# Altium schematic sheet SmartLED.SchDoc: Smart LED
size B; SheetNumber: 2; SheetTotal: 6
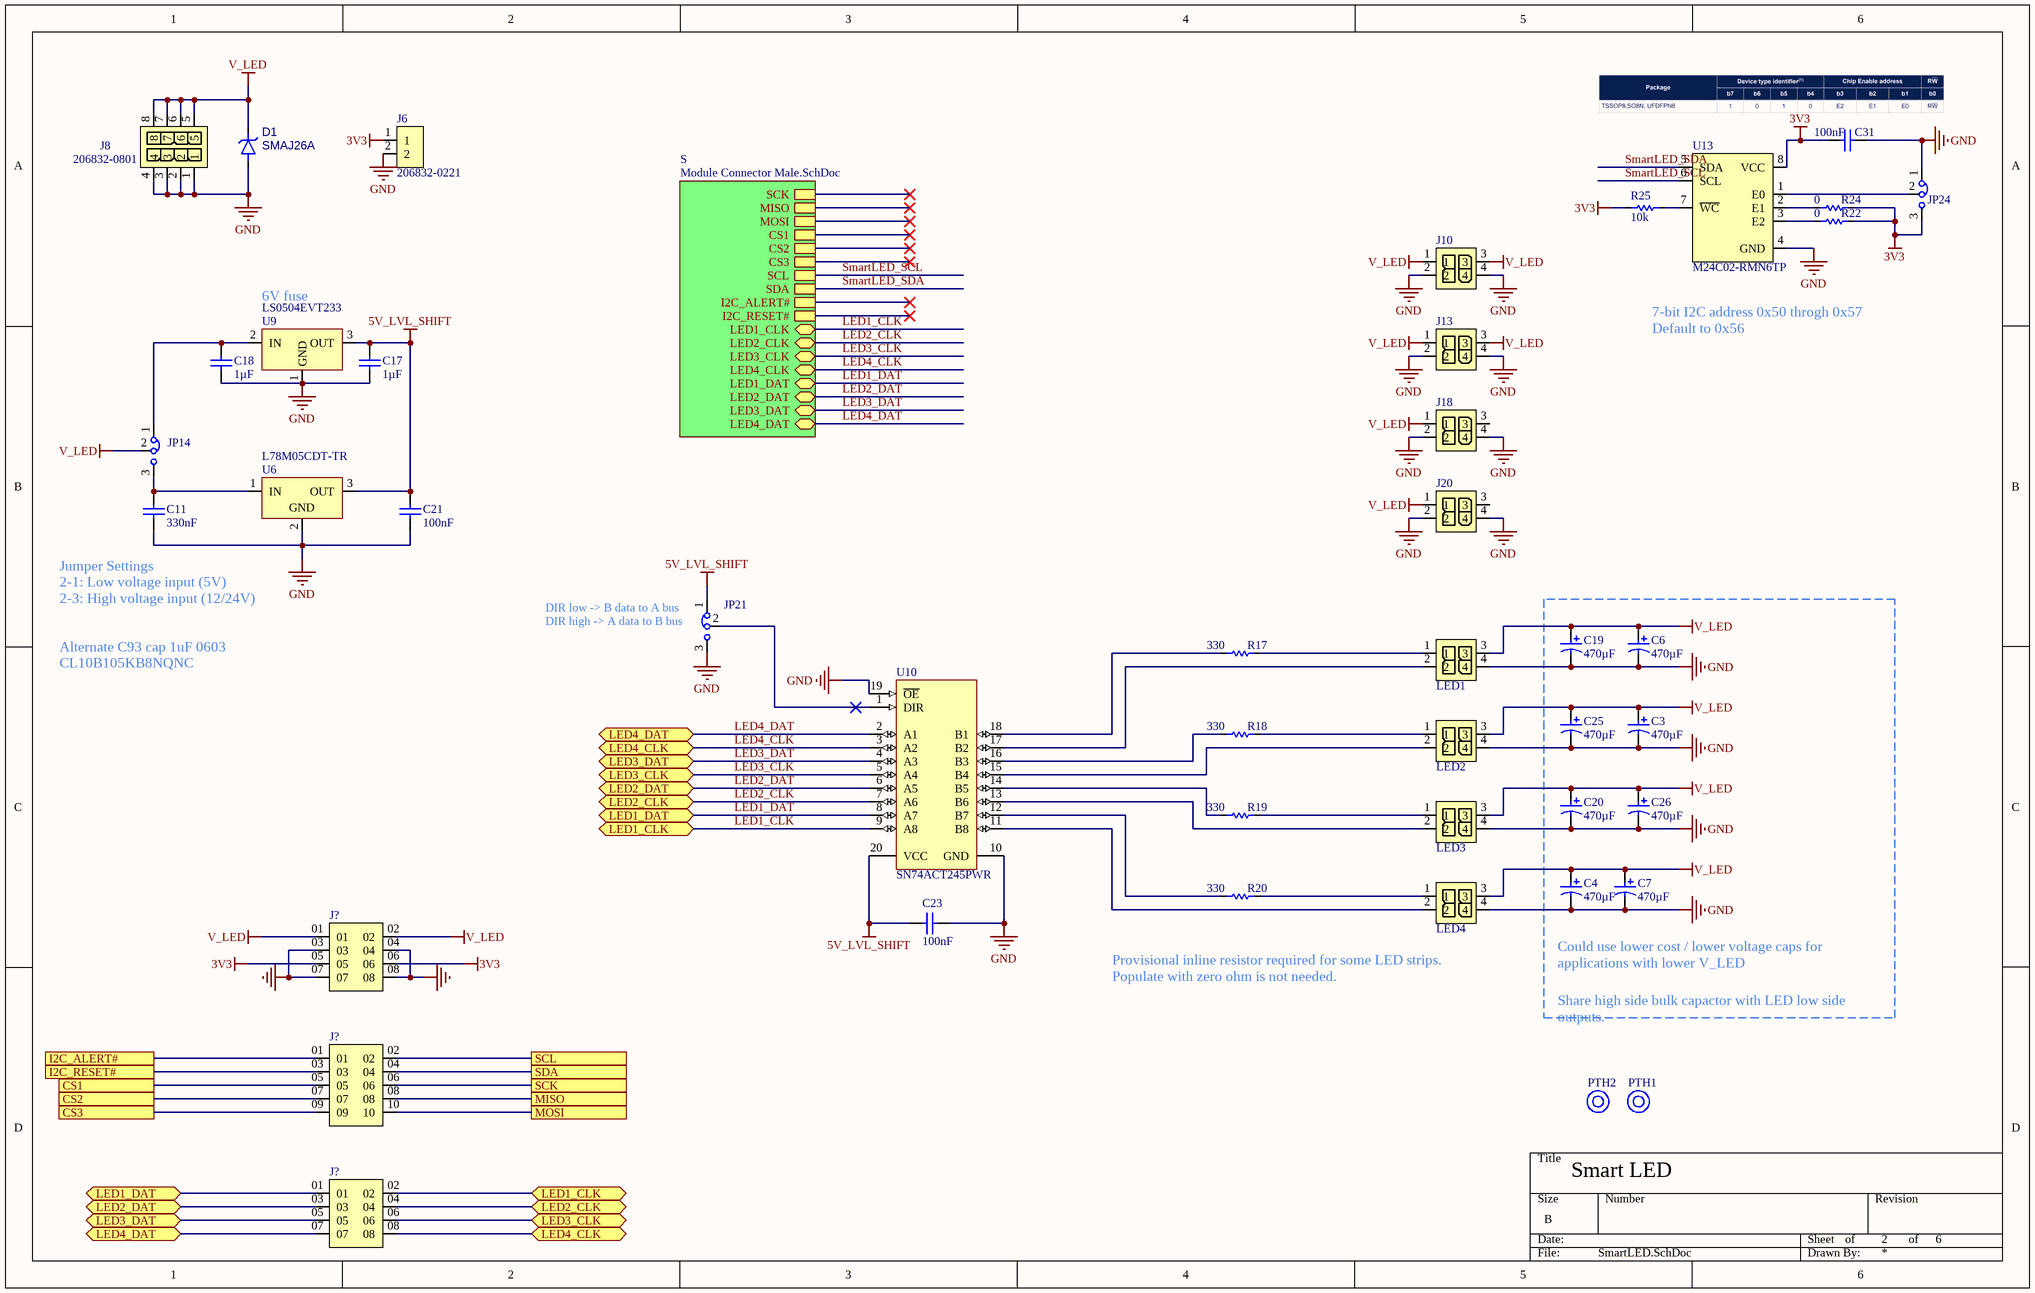
[diagram p0: SmartLED.SchDoc]

## Parts
(Parts that share a designator on the sheet are numbered #1, #2 ... from top to bottom, then left to right.)
C3  value 470µF  [CAP_POL_DIAM10_H22_SPACING5]  (hidden comment: REH1020471M050K)
C4  value 470µF  [CAP_POL_DIAM10_H22_SPACING5]  (hidden comment: REH1020471M050K)
C6  value 470µF  [CAP_POL_DIAM10_H22_SPACING5]  (hidden comment: REH1020471M050K)
C7  value 470µF  [CAP_POL_DIAM10_H22_SPACING5]  (hidden comment: REH1020471M050K)
C11  value 330nF  [CAPC1608X10N_0603_MED]  (hidden comment: CGA3E3X7R1H334K080AB)
C17  value 1µF  [CAPC1608X10N_0603_MED]  (hidden comment: C1608X7R1C105K080AC)
C18  value 1µF  [CAPC2012X14N_0805_MED]  (hidden comment: CL21B105KBFNNNE)
C19  value 470µF  [CAP_POL_DIAM10_H22_SPACING5]  (hidden comment: REH1020471M050K)
C20  value 470µF  [CAP_POL_DIAM10_H22_SPACING5]  (hidden comment: REH1020471M050K)
C21  value 100nF  [CAPC1608X10N_0603_MED]  (hidden comment: CC0603KRX7R0BB104)
C23  value 100nF  [CAPC1608X10N_0603_MED]  (hidden comment: CC0603KRX7R0BB104)
C25  value 470µF  [CAP_POL_DIAM10_H22_SPACING5]  (hidden comment: REH1020471M050K)
C26  value 470µF  [CAP_POL_DIAM10_H22_SPACING5]  (hidden comment: REH1020471M050K)
C31  value 100nF  [CAPC1608X10N_0603_MED]  (hidden comment: CC0603KRX7R0BB104)
D1  SMAJ26A  [FP-SMAJ-MFG]
J6  206832-0221  [206832-0221-Footprint-1]
J8  206832-0801  [206832-0801-Footprint-1]
J10  212528-0430  [212528-0430-Footprint-1]  (value not drawn)
J13  212528-0430  [212528-0430-Footprint-1]  (value not drawn)
J18  212528-0430  [212528-0430-Footprint-1]  (value not drawn)
J20  212528-0430  [212528-0430-Footprint-1]  (value not drawn)
J?#1  Header 4x2 0.1" RA  [Header 4x2 0.1" RA]  (value not drawn)
J?#2  Header 5x2 0.1" RA  [Header 5x2 0.1" RA]  (value not drawn)
J?#3  Header 4x2 0.1" RA  [Header 4x2 0.1" RA]  (value not drawn)
JP14  Jumper 3 x 1 Bridge 1-2 0.1"  [FP-PR20203VBNN-MFG]  (value not drawn)
JP21  Jumper 3 x 1 Bridge 1-2 Solder Bridge  [Jumper 3 Solder Bridge 1-2 0603]  (value not drawn)
JP24  Jumper 3 x 1 Bridge 1-2 Solder Bridge  [Jumper 3 Solder Bridge 1-2 0603]  (value not drawn)
LED1  212528-0400  [212528-0400-Footprint-1]  (value not drawn)
LED2  212528-0400  [212528-0400-Footprint-1]  (value not drawn)
LED3  212528-0400  [212528-0400-Footprint-1]  (value not drawn)
LED4  212528-0400  [212528-0400-Footprint-1]  (value not drawn)
PTH1  Mounting Hole NPTH  [Mounting Hole M3 No Washer NPTH]  (value not drawn)  (no BOM)
PTH2  Mounting Hole NPTH  [Mounting Hole M3 No Washer NPTH]  (value not drawn)  (no BOM)
R17  value 330  [RESC1608X06N_0603_MED]  (hidden comment: RC0603FR-07330RL)
R18  value 330  [RESC1608X06N_0603_MED]  (hidden comment: RC0603FR-07330RL)
R19  value 330  [RESC1608X06N_0603_MED]  (hidden comment: RC0603FR-07330RL)
R20  value 330  [RESC1608X06N_0603_MED]  (hidden comment: RC0603FR-07330RL)
R22  value 0  [RESC1608X06N_0603_MED]  (hidden comment: RC0603FR-070RL)
R24  value 0  [RESC1608X06N_0603_MED]  (hidden comment: RC0603FR-070RL)
R25  value 10k  [RESC1608X06N_0603_MED]  (hidden comment: RC0603FR-1010KL)
U6  L78M05CDT-TR  [L78M05CDT-TR-Footprint-1]
U9  LS0504EVT233  [SOT95P280X100-3N]
U10  SN74ACT245PWR  [PW0020A_L]
U13  M24C02-RMN6TP  [M24C02-RMN6TP-SO8N-IPC_B]

## Sub-sheets
S = Module Connector Male.SchDoc: SCK (harness MOD_CONN), MISO, MOSI, CS1, CS2, CS3, SCL, SDA, I2C_ALERT#, I2C_RESET#, LED1_CLK (bidir), LED2_CLK (bidir), LED3_CLK (bidir), LED4_CLK (bidir), LED1_DAT (bidir), LED2_DAT (bidir), LED3_DAT (bidir), LED4_DAT (bidir)

## Ports
CS1, CS2, CS3, I2C_ALERT#, I2C_RESET#, LED1_CLK (bidir), LED1_DAT (bidir), LED2_CLK (bidir), LED2_DAT (bidir), LED3_CLK (bidir), LED3_DAT (bidir), LED4_CLK (bidir), LED4_DAT (bidir), MISO, MOSI, SCK, SCL, SDA

## Nets
3V3: C31.1 J6.1 J?#1.05 J?#1.06 JP24.3 R22.1 R24.1 R25.2 U13.8(VCC)
5V_LVL_SHIFT: C17.2 C21.1 C23.2 JP21.1 U6.3(OUT) U9.3(OUT) U10.20(VCC)
GND: C3.2 C4.2 C6.2 C7.2 C11.1 C17.1 C18.1 C19.2 C20.2 C21.2 C23.1 C25.2 C26.2 C31.2 D1.2(A) J6.2 J8.1 J8.2 J8.3 J8.4 J10.2 J10.4 J13.2 J13.4 J18.2 J18.4 J20.2 J20.4 J?#1.03 J?#1.04 J?#1.07 J?#1.08 JP21.3 JP24.1 LED1.4 LED2.4 LED3.4 LED4.4 U6.2(GND) U9.1(GND) U10.10(GND) U10.19(~{OE}) U13.4(GND)
V_LED: C3.1 C4.1 C6.1 C7.1 C19.1 C20.1 C25.1 C26.1 D1.1(K) J8.5 J8.6 J8.7 J8.8 J10.1 J10.3 J13.1 J13.3 J18.1 J20.1 J?#1.01 J?#1.02 JP14.2 LED1.3 LED2.3 LED3.3 LED4.3
CS1: J?#2.05 ; port CS1
CS2: J?#2.07 ; port CS2
CS3: J?#2.09 ; port CS3
I2C_ALERT#: J?#2.01 ; port I2C_ALERT#
I2C_RESET#: J?#2.03 ; port I2C_RESET#
LED1_CLK: J?#3.02 U10.9(A8) ; port LED1_CLK, sheet S/LED1_CLK
LED1_DAT: J?#3.01 U10.8(A7) ; port LED1_DAT, sheet S/LED1_DAT
LED2_CLK: J?#3.04 U10.7(A6) ; port LED2_CLK, sheet S/LED2_CLK
LED2_DAT: J?#3.03 U10.6(A5) ; port LED2_DAT, sheet S/LED2_DAT
LED3_CLK: J?#3.06 U10.5(A4) ; port LED3_CLK, sheet S/LED3_CLK
LED3_DAT: J?#3.05 U10.4(A3) ; port LED3_DAT, sheet S/LED3_DAT
LED4_CLK: J?#3.08 U10.3(A2) ; port LED4_CLK, sheet S/LED4_CLK
LED4_DAT: J?#3.07 U10.2(A1) ; port LED4_DAT, sheet S/LED4_DAT
MISO: J?#2.08 ; port MISO
MOSI: J?#2.10 ; port MOSI
SCK: J?#2.06 ; port SCK
SCL: J?#2.02 ; port SCL
SDA: J?#2.04 ; port SDA
SmartLED_SCL: U13.6(SCL) ; sheet S/SCL
SmartLED_SDA: U13.5(SDA) ; sheet S/SDA
NetC11_2: C11.2 JP14.3 U6.1(IN)
NetC18_2: C18.2 JP14.1 U9.2(IN)
NetJP21_2: JP21.2 U10.1(DIR)
NetJP24_2: JP24.2 U13.1(E0)
NetLED1_1: LED1.1 R17.2
NetLED1_2: LED1.2 U10.17(B2)
NetLED2_1: LED2.1 R18.2
NetLED2_2: LED2.2 U10.15(B4)
NetLED3_1: LED3.1 R19.2
NetLED3_2: LED3.2 U10.13(B6)
NetLED4_1: LED4.1 R20.2
NetLED4_2: LED4.2 U10.11(B8)
NetR17_1: R17.1 U10.18(B1)
NetR18_1: R18.1 U10.16(B3)
NetR19_1: R19.1 U10.14(B5)
NetR20_1: R20.1 U10.12(B7)
NetR22_2: R22.2 U13.3(E2)
NetR24_2: R24.2 U13.2(E1)
NetR25_1: R25.1 U13.7(~{WC})

Not connected (* = marked no-connect by the designer): J18 3; J20 3

## Notes on the sheet
- (near U9) 6V fuse
- 7-bit I2C address 0x50 throgh 0x57
  Default to 0x56
- Jumper Settings
  2-1: Low voltage input (5V)
  2-3: High voltage input (12/24V)
- (near JP21) DIR low -> B data to A bus
  DIR high -> A data to B bus
- Alternate C93 cap 1uF 0603 CL10B105KB8NQNC
- Could use lower cost / lower voltage caps for applications with lower V_LED
- Provisional inline resistor required for some LED strips. Populate with zero ohm is not needed.
- Share high side bulk capactor with LED low side outputs.
- of

## Library data of the parts
C3 C4 C6 C7 C19 C20 C25 C26 = CMP-001-00166-1: CAP ALUM 470UF 20% 50V RADIAL TH; Capacitor Type: Aluminium; RoHS Compliant: Yes; Case/Package: Radial; Tolerance: 20%; Voltage Rating: 50V; Min Operating Temperature: 125°C; Max Operating Temperature: -40°C; Mounting Technology: Through Hole; Pins: 2
C11 = CMP-001-00167-2: Ceramic Capacitor, Multilayer, Ceramic, 50V, 10% +Tol, 10% -Tol, X7R, 15% TC, 0.33uF, Surface Mount, 0603; Voltage Rating: 100V; Case/Package: 0603; Min Operating Temperature: -55°C; RoHS Compliant: Yes; Max Operating Temperature: 125°C; Pins: 2; Capacitor Type: Ceramic; Mounting Technology: Surface Mount; JLCPN: C5199872
C17 = CMP-001-00121-2: Ceramic Capacitor, Multilayer, Ceramic, 16V, 10% +Tol, 10% -Tol, X7R, 15% TC, 1uF, Surface Mount, 0603; Capacitor Type: Ceramic; RoHS Compliant: Yes; Min Operating Temperature: -55°C; Pins: 2; Tolerance: 10%; Max Operating Temperature: 125°C; Mounting Technology: Surface Mount; Voltage Rating: 16V; Case/Package: 0603; JLCPN: C59782
C18 = CMP-001-00171-2: Ceramic Capacitor, Multilayer, Ceramic, 1uF, 50V, 10%, XRS, 0805; Max Operating Temperature: 125°C; RoHS Compliant: Yes; Mounting Technology: Surface Mount; Case/Package: 0805; Tolerance: 10%; Pins: 2; Voltage Rating: 50V; Min Operating Temperature: -55°C; Capacitor Type: Ceramic; JLCPN: C28323
C21 C23 C31 = CMP-001-00102-4: Ceramic Capacitor, Multilayer, Ceramic, 100V, 10% +Tol, 10% -Tol, X7R, 15% TC, 0.1uF, Surface Mount, 0603; Max Operating Temperature: 125°C; RoHS Compliant: Yes; Case/Package: 0603; Mounting Technology: Surface Mount; Capacitor Type: Ceramic; Pins: 2; Voltage Rating: 100V; Min Operating Temperature: -55°C; JLCPN: C113803
D1 = CMP-004-00046-2: Trans Voltage Suppressor Diode, 400W, 26V V(RWM), Unidirectional, 1 Element, Silicon, DO-214AC; Min Operating Temperature: -65°C; RoHS Compliant: Yes; Max Operating Temperature: 150°C; Pins: 2; JLCPN: C148225
J6 = CMP-002-00210-4: Micro-Fit+, Vertial Header, 2 Position 3mm pitch; Max Current Rating: 12.5A; Gender: Male; Pins: 2; Connector Type: Micro-Fit+
J8 = CMP-002-00208-6: Micro-Fit+, Vertical Header, 8 pin; Max Current Rating: 12.5A; Connector Type: Micro-Fit+; Mounting Technology: Through Hole; Pins: 8
J10 J13 J18 J20 = CMP-002-00220-4: Micro-Fit+, RA Header, 4 Position, Blue D-Key; Max Current Rating: 12.5A; Gender: Male; Mounting Technology: Through Hole; Max Operating Temperature: 125°C; Pins: 4; Min Operating Temperature: -40°C; Connector Type: Micro-Fit+
J?#1 J?#3 = CMP-002-00226-4: Board Connector, 8 Contact(s), 2 Row(s), Female, Right Angle, 0.1 inch Pitch; Gender: Male; Max Current Rating: 3A; Connector Type: BOARD CONNECTOR; RoHS Compliant: Yes; Max Operating Temperature: 105°C; Min Operating Temperature: -40°C; Mounting Technology: Board; Pins: 8
J?#2 = CMP-002-00230-4: Board Connector, 10 Contact(s), 2 Row(s), Female, Right Angle, 0.1 inch Pitch; Gender: Male; Max Current Rating: 3A; Min Operating Temperature: -40°C; Pins: 10; Mounting Technology: Board; Max Operating Temperature: 125°C; Connector Type: BOARD CONNECTOR; RoHS Compliant: Yes
JP14 = CMP-002-00084-6: Pins: 3
JP21 JP24 = CMP-009-00341-2: 0603 Solder Bridge Jumper Surface Mount; Tolerance: 1%; Voltage Rating: 75V; Value: 0; Pins: 2; Case/Package: 0603; RoHS Compliant: Yes; Max Operating Temperature: 155°C; Min Operating Temperature: -55°C; Mounting Technology: Surface Mount
LED1-LED4 = CMP-002-00219-3: Micro-Fit+, RA Header, 4 Position, Black A-Key; Gender: Male; Max Current Rating: 12.5A; Connector Type: Micro-Fit+; Pins: 4; Mounting Technology: Through Hole
PTH1 PTH2 = CMP-00028-00043-3
R17-R20 = CMP-009-00302-2: Fixed Resistor, Metal Glaze/thick Film, 0.1W, 330ohm, 75V, 1% +/-Tol, 100ppm/Cel, Surface Mount, 0603; Power: 100mW; Voltage Rating: 50V; Min Operating Temperature: -55°C; Pins: 2; RoHS Compliant: Yes; Tolerance: 1%; Mounting Technology: Surface Mount; Max Operating Temperature: 155°C; Case/Package: 0603; JLCPN: C105881
R22 R24 = CMP-009-00204-3: RC Series 0603 0.1 W 0 Ohm Jumper Surface Mount Thick Film Chip Resistor; Power: 100mW; Voltage Rating: 75V; Tolerance: 1%; Mounting Technology: Surface Mount; Pins: 2; Case/Package: 0603; Max Operating Temperature: 155°C; Min Operating Temperature: -55°C; RoHS Compliant: Yes; JLCPN: C100044
R25 = CMP-009-00306-2: Fixed Resistor, Metal Glaze/thick Film, 0.1W, 10000ohm, 75V, 1% +/-Tol, 100ppm/Cel, Surface Mount, 0603; Power: 100mW; Voltage Rating: 50V; Max Operating Temperature: 155°C; Case/Package: 0603; Mounting Technology: Surface Mount; Tolerance: 1%; Min Operating Temperature: -55°C; RoHS Compliant: Yes; Pins: 2; JLCPN: C98220
U6 = CMP-019-00076-2: Fixed Positive Standard Regulator, 5VBIPolar, PSSO2; Output Current: 500mA; Output Voltage: 5V; Max Supply Voltage: 25V; RoHS Compliant: Yes; Pins: 2; Case/Package: TO-252; JLCPN: C55509
U9 = CMP-005-00015-4: E-Fuse, LS0504 Series Single Channel 4 A High Side SMT Power Switch - SOT-23-3; Current Rating: 4A; Case/Package: SOT-23; Pins: 3
U10 = CMP-016-00027-3: Bus Transceiver, ACT Series, 1-Func, 8-Bit, True Output, CMOS, PDSO20; Min Supply Voltage: 4.5V; Max Supply Voltage: 5.5V; Nominal Supply Voltage: 5V; Min Operating Temperature: -40°C; RoHS Compliant: Yes; Case/Package: TSSOP; Pins: 20; Max Operating Temperature: 85°C; Logic Type: BUS TRANSCEIVER; JLCPN: C6931
U13 = CMP-019-00078-2: M24C02 Series 2 Kb (256 x 8) 1.8 V SMT Serial I²C Bus EEPROM - SOIC-8; Max Supply Voltage: 5.5V; Min Supply Voltage: 1.8V; Frequency: 400kHz; Memory Size: 256B; Case/Package: SOIC; Pins: 8; Clock Frequency: 400kHz; Min Operating Temperature: -40°C; Memory Format: EEPROM; Max Operating Temperature: 85°C; Mounting Technology: Surface Mount; JLCPN: C83836